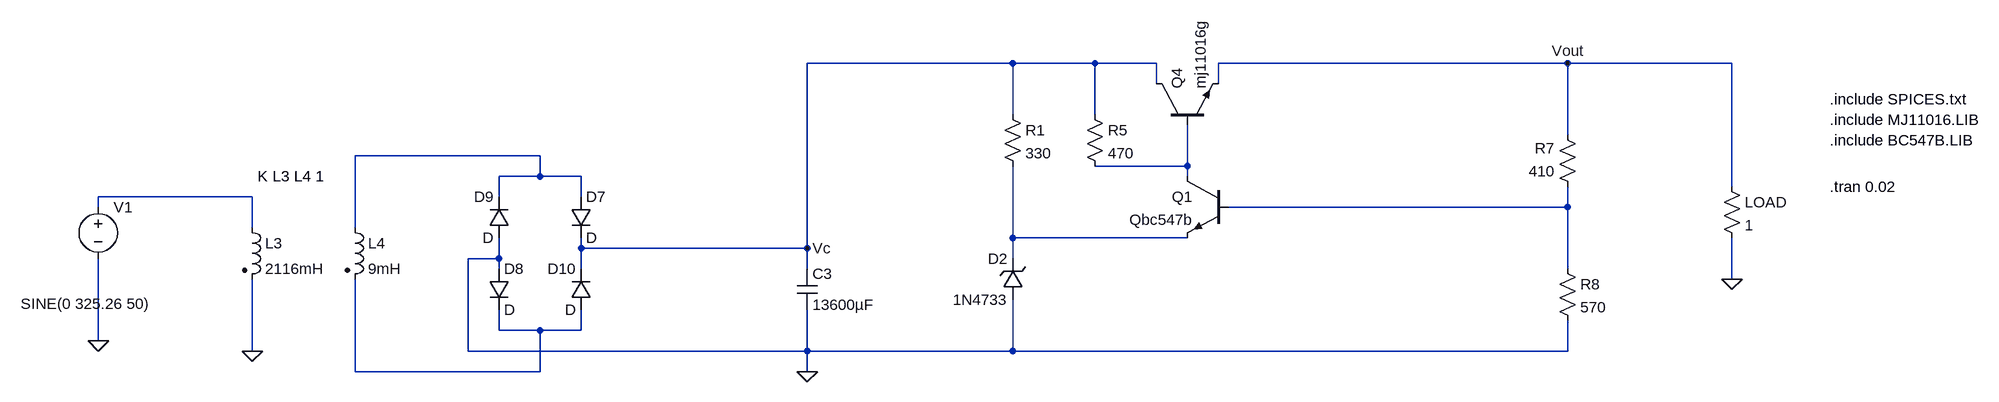
[diagram p0: schematic Basic Sketch 1.asc]
Basic Sketch 1.asc, the LTspice schematic file:
Version 4
SHEET 1 2968 1604
WIRE 1296 720 976 720
WIRE 1424 720 1296 720
WIRE 1520 720 1424 720
WIRE 2160 720 1616 720
WIRE 2416 720 2160 720
WIRE 1520 752 1520 720
WIRE 1616 752 1616 720
WIRE 1296 800 1296 720
WIRE 1424 800 1424 720
WIRE 2160 832 2160 720
WIRE 560 864 272 864
WIRE 1568 880 1568 816
WIRE 1568 880 1424 880
WIRE 560 896 560 864
WIRE 560 896 496 896
WIRE 624 896 560 896
WIRE 1568 896 1568 880
WIRE 2416 912 2416 720
WIRE 112 928 -128 928
WIRE 496 928 496 896
WIRE 624 928 624 896
WIRE -128 944 -128 928
WIRE 2160 944 2160 912
WIRE 2160 944 1632 944
WIRE 112 976 112 928
WIRE 272 976 272 864
WIRE 1296 992 1296 880
WIRE 1568 992 1296 992
WIRE 624 1008 624 992
WIRE 976 1008 976 720
WIRE 976 1008 624 1008
WIRE 496 1024 496 992
WIRE 496 1024 448 1024
WIRE 1296 1024 1296 992
WIRE 496 1040 496 1024
WIRE 624 1040 624 1008
WIRE 976 1040 976 1008
WIRE 2160 1040 2160 944
WIRE 2416 1056 2416 992
WIRE 496 1136 496 1104
WIRE 560 1136 496 1136
WIRE 624 1136 624 1104
WIRE 624 1136 560 1136
WIRE -128 1152 -128 1024
WIRE 112 1168 112 1056
WIRE 448 1168 448 1024
WIRE 976 1168 976 1104
WIRE 976 1168 448 1168
WIRE 1296 1168 1296 1088
WIRE 1296 1168 976 1168
WIRE 2160 1168 2160 1120
WIRE 2160 1168 1296 1168
WIRE 272 1200 272 1056
WIRE 560 1200 560 1136
WIRE 560 1200 272 1200
WIRE 976 1200 976 1168
FLAG -128 1152 0
FLAG 112 1168 0
FLAG 976 1200 0
FLAG 2416 1056 0
FLAG 2160 720 Vout
FLAG 976 1008 Vc
SYMBOL voltage -128 928 R0
WINDOW 123 0 0 Left 0
WINDOW 39 0 0 Left 0
WINDOW 3 -121 166 Left 2
SYMATTR Value SINE(0 325.26 50)
SYMATTR InstName V1
SYMBOL ind2 96 960 R0
SYMATTR InstName L3
SYMATTR SpiceLine Rser=0.001
SYMATTR Value 2116mH
SYMATTR Type ind
SYMBOL ind2 256 960 R0
SYMATTR InstName L4
SYMATTR Value 9mH
SYMATTR Type ind
SYMBOL diode 608 928 R0
SYMATTR InstName D7
SYMBOL diode 480 1040 R0
SYMATTR InstName D8
SYMBOL diode 512 992 R180
WINDOW 0 24 64 Left 2
WINDOW 3 24 0 Left 2
SYMATTR InstName D9
SYMBOL diode 640 1104 R180
WINDOW 0 24 64 Left 2
WINDOW 3 24 0 Left 2
SYMATTR InstName D10
SYMBOL cap 960 1040 R0
SYMATTR InstName C3
SYMATTR Value 13600µF
SYMBOL npn 1520 816 R270
SYMATTR InstName Q4
SYMATTR Value mj11016g
SYMATTR Prefix X
SYMBOL res 1408 784 R0
SYMATTR InstName R5
SYMATTR Value 470
SYMBOL res 2176 928 R180
WINDOW 0 36 76 Left 2
WINDOW 3 36 40 Left 2
SYMATTR InstName R7
SYMATTR Value 410
SYMBOL res 2144 1024 R0
SYMATTR InstName R8
SYMATTR Value 570
SYMBOL res 2400 896 R0
SYMATTR InstName LOAD
SYMATTR Value 1
SYMBOL res 1280 784 R0
SYMATTR InstName R1
SYMATTR Value 330
SYMBOL zener 1312 1088 R180
WINDOW 0 24 64 Left 2
WINDOW 3 24 0 Left 2
SYMATTR InstName D2
SYMATTR Value 1N4733
SYMBOL npn 1632 896 M0
SYMATTR InstName Q1
SYMATTR Value Qbc547b
SYMATTR Prefix Q
TEXT 120 896 Left 2 !K L3 L4 1
TEXT 2568 776 Left 2 !.include SPICES.txt
TEXT 2568 808 Left 2 !.include MJ11016.LIB
TEXT 2568 840 Left 2 !.include BC547B.LIB
TEXT 2568 912 Left 2 !.tran 0.02

The netlist it stands for:
* Basic Sketch 1.asc
V1 N003 0 SINE(0 325.26 50)
L3 N003 0 2116mH Rser=0.001
L4 N001 N006 9mH
D7 N001 Vc D
D8 0 N006 D
D9 0 N001 D
D10 N006 Vc D
C3 Vc 0 13600µF
XQ4 Vc N002 Vout mj11016g  ; pins C B E
R5 Vc N002 470
R7 N004 Vout 410
R8 N004 0 570
R§LOAD Vout 0 1
R1 Vc N005 330
D2 0 N005 1N4733
Q1 N002 N004 N005 0 Qbc547b
.model D D
.lib standard.dio
.model NPN NPN
.model PNP PNP
.lib standard.bjt
K L3 L4 1
.include SPICES.txt
.include MJ11016.LIB
.include BC547B.LIB
.tran 0.02
.backanno
.end